# Altium project Arduino_Design_Project.PrjPcb
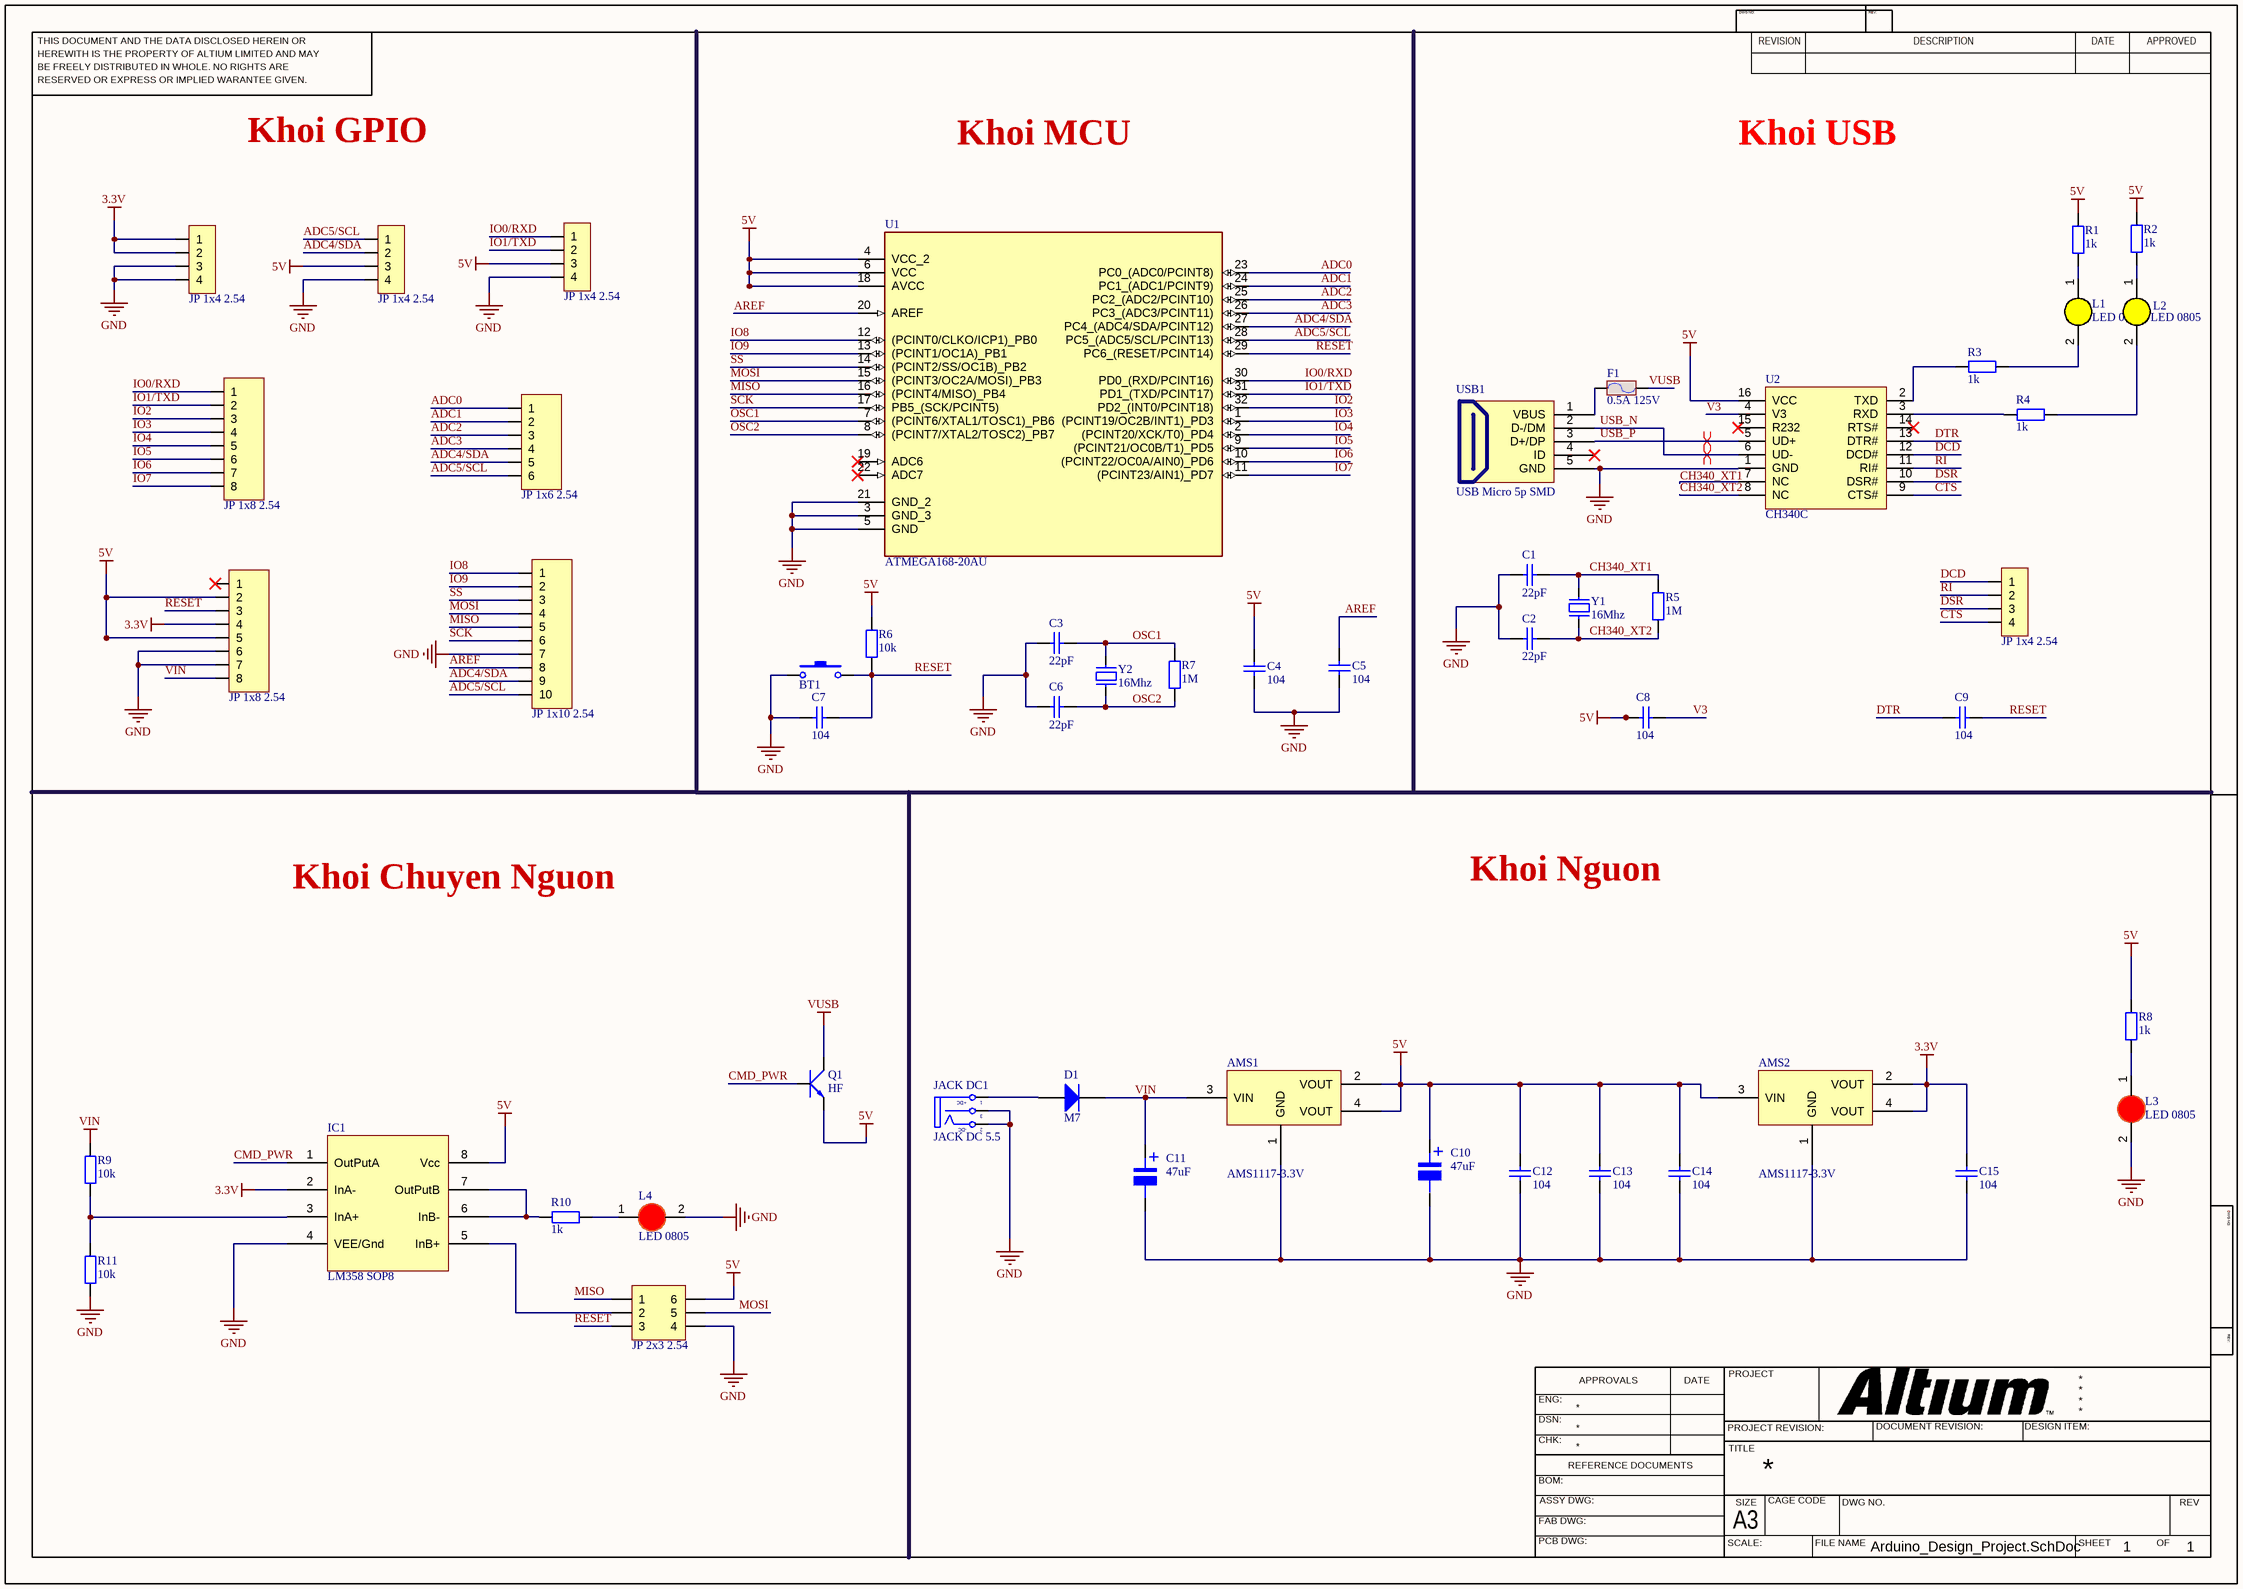
[diagram p0: Arduino_Design_Project.SchDoc]
1 sheet, 52 parts. Net scope: global (net labels, ports and power ports of the same name join across sheets).
Board file: Arduino_Design_Project.PcbDoc

## Sheet Arduino_Design_Project.SchDoc
size 420 x 297 mm; SheetNumber: 1; SheetTotal: 1

### Parts
AMS1  AMS1117-3.3V  [SOT223]
AMS2  AMS1117-3.3V  [SOT223]
BT1  Nut Nhan 2 Chan SMD 3x6x2.5  [Nut Nhan 2 Chan SMD 3x6x2.5]  (value not drawn)
C1  22pF  [tu 0805]
C2  22pF  [tu 0805]
C3  22pF  [tu 0805]
C4  104  [tu 0805]
C5  104  [tu 0805]
C6  22pF  [tu 0805]
C7  104  [tu 0805]
C8  104  [tu 0805]
C9  104  [tu 0805]
C10  47uF  [tu nhom 6.3 (d)]
C11  47uF  [tu nhom 6.3 (d)]
C12  104  [tu 0805]
C13  104  [tu 0805]
C14  104  [tu 0805]
C15  104  [tu 0805]
D1  M7  [DIODE SMA]
F1  0.5A 125V  [Cau Chi SMD1808]
IC1  LM358 SOP8  [SOP 8]
JACK_DC1  JACK DC 5.5  [JACK DC 5.5]
JP1  JP 1x4 2.54  [JP 1x4 CT]
JP2  JP 1x4 2.54  [JP 1x4 CT]
JP3  JP 1x4 2.54  [JP 1x4 CT]
JP4  JP 1x8 2.54  [JP 1x8 CT]
JP5  JP 1x6 2.54  [JP 1x6 CT]
JP6  JP 1x10 2.54  [JP 1x10 CT]
JP7  JP 1x4 2.54  [JP 1x4 CT]
JP8  JP 1x8 2.54  [JP 1x8 CT]
JP9  JP 2x3 2.54  [JP 2x3 DT]
L1  LED 0805  [LED-0805-Yellow]
L2  LED 0805  [LED-0805-Yellow]
L3  LED 0805  [LED-0805-Red]
L4  LED 0805  [LED-0805-Red]
Q1  HF  [SOT-23]
R1  1k  [tro smd 0805]
R2  1k  [tro smd 0805]
R3  1k  [tro smd 0805]
R4  1k  [tro smd 0805]
R5  1M  [tro smd 0805]
R6  10k  [tro smd 0805]
R7  1M  [tro smd 0805]
R8  1k  [tro smd 0805]
R9  10k  [tro smd 0805]
R10  1k  [tro smd 0805]
R11  10k  [tro smd 0805]
U1  ATMEGA168-20AU  [ATMEGA168]
U2  CH340C  [SOIC16_50_284_25X90_SMT]
USB1  USB Micro 5p SMD  [USB Micro 5p SMD]
Y1  16Mhz  [Thach Anh 2 chan SMD]
Y2  16Mhz  [Thach Anh 2 chan SMD]

### Nets
3.3V: AMS2.2(VOUT) AMS2.4(VOUT) C15.1 IC1.2(InA-) JP2.1 JP2.2 JP8.4
5V: AMS1.2(VOUT) AMS1.4(VOUT) AMS2.3(VIN) C4.1 C8.2 C10.1 C12.1 C13.1 C14.1 IC1.8(Vcc) JP1.3 JP3.3 JP8.2 JP8.5 JP9.6 Q1.2(E) R1.1 R2.2 R6.1 R8.2 U1.4(VCC_2) U1.6(VCC) U1.18(AVCC) U2.16(VCC)
GND: AMS1.1(GND) AMS2.1(GND) BT1.1 C1.2 C2.2 C3.2 C4.2 C5.1 C6.2 C7.2 C10.2 C11.2 C12.2 C13.2 C14.2 C15.2 IC1.4(VEE/Gnd) JACK_DC1.2(TN) JACK_DC1.3(S) JP1.4 JP2.3 JP2.4 JP3.4 JP6.7 JP8.6 JP8.7 JP9.4 L3.2(K) L4.2(K) R11.1 U1.3(GND_3) U1.5(GND) U1.21(GND_2) U2.1(GND) USB1.5(GND)
VIN: AMS1.3(VIN) C11.1 D1.2(K) JP8.8 R9.2
VUSB: F1.2 Q1.3(C)
ADC0: JP5.1 U1.23(PC0_(ADC0/PCINT8))
ADC1: JP5.2 U1.24(PC1_(ADC1/PCINT9))
ADC2: JP5.3 U1.25(PC2_(ADC2/PCINT10))
ADC3: JP5.4 U1.26(PC3_(ADC3/PCINT11))
ADC4/SDA: JP3.2 JP5.5 JP6.9 U1.27(PC4_(ADC4/SDA/PCINT12))
ADC5/SCL: JP3.1 JP5.6 JP6.10 U1.28(PC5_(ADC5/SCL/PCINT13))
AREF: C5.2 JP6.8 U1.20(AREF)
CH340_XT1: C1.1 R5.2 U2.7(NC) Y1.2
CH340_XT2: C2.1 R5.1 U2.8(NC) Y1.1
CMD_PWR: IC1.1(OutPutA) Q1.1(B)
CTS: JP7.4 U2.9(CTS#)
DCD: JP7.1 U2.12(DCD#)
DSR: JP7.3 U2.10(DSR#)
DTR: C9.1 U2.13(DTR#)
IO0/RXD: JP1.1 JP4.1 U1.30(PD0_(RXD/PCINT16))
IO1/TXD: JP1.2 JP4.2 U1.31(PD1_(TXD/PCINT17))
IO2: JP4.3 U1.32(PD2_(INT0/PCINT18))
IO3: JP4.4 U1.1((PCINT19/OC2B/INT1)_PD3)
IO4: JP4.5 U1.2((PCINT20/XCK/T0)_PD4)
IO5: JP4.6 U1.9((PCINT21/OC0B/T1)_PD5)
IO6: JP4.7 U1.10((PCINT22/OC0A/AIN0)_PD6)
IO7: JP4.8 U1.11((PCINT23/AIN1)_PD7)
IO8: JP6.1 U1.12((PCINT0/CLKO/ICP1)_PB0)
IO9: JP6.2 U1.13((PCINT1/OC1A)_PB1)
MISO: JP6.5 JP9.1 U1.16((PCINT4/MISO)_PB4)
MOSI: JP6.4 JP9.5 U1.15((PCINT3/OC2A/MOSI)_PB3)
OSC1: C3.1 R7.2 U1.7((PCINT6/XTAL1/TOSC1)_PB6) Y2.2
OSC2: C6.1 R7.1 U1.8((PCINT7/XTAL2/TOSC2)_PB7) Y2.1
RESET: BT1.2 C7.1 C9.2 JP8.3 JP9.3 R6.2 U1.29(PC6_(RESET/PCINT14))
RI: JP7.2 U2.11(RI#)
SCK: JP6.6 U1.17(PB5_(SCK/PCINT5))
SS: JP6.3 U1.14((PCINT2/SS/OC1B)_PB2)
USB_N: U2.6(UD-) USB1.2(D-/DM)
USB_P: U2.5(UD+) USB1.3(D+/DP)
V3: C8.1 U2.4(V3)
NetD1_1: D1.1(A) JACK_DC1.1(T)
NetF1_1: F1.1 USB1.1(VBUS)
NetIC1_3: IC1.3(InA+) R9.1 R11.2
NetIC1_5: IC1.5(InB+) JP9.2
NetIC1_6: IC1.6(InB-) IC1.7(OutPutB) R10.2
NetL1_1: L1.1(A) R1.2
NetL1_2: L1.2(K) R3.1
NetL2_1: L2.1(A) R2.1
NetL2_2: L2.2(K) R4.2
NetL3_1: L3.1(A) R8.1
NetL4_1: L4.1(A) R10.1
NetR3_2: R3.2 U2.2(TXD)
NetR4_1: R4.1 U2.3(RXD)

Not connected (* = marked no-connect by the designer): JP8 1*; U1 19(ADC6)* 22(ADC7)*; U2 14(RTS#)* 15(R232)*; USB1 4(ID)*

### Layout directives
differential pair: USB_N, USB_P

### Notes on the sheet
- Khoi GPIO
- Khoi MCU
- Khoi USB
- Khoi Chuyen Nguon
- Khoi Nguon
- THIS DOCUMENT AND THE DATA DISCLOSED HEREIN OR
- HEREWITH IS THE PROPERTY OF ALTIUM LIMITED AND MAY
- DWG NO:
- REVISION
- REV:
- DESCRIPTION
- DATE
- APPROVED
- BE FREELY DISTRIBUTED IN WHOLE. NO RIGHTS ARE
- RESERVED OR EXPRESS OR IMPLIED WARANTEE GIVEN.
- ENG:
- APPROVALS
- PROJECT
- DSN:
- CHK:
- REFERENCE DOCUMENTS
- PROJECT REVISION:
- TITLE
- DOCUMENT REVISION:
- DESIGN ITEM:
- BOM:
- FAB DWG:
- PCB DWG:
- ASSY DWG:
- SCALE:
- A3
- SIZE
- CAGE CODE
- FILE NAME
- DWG NO.
- SHEET
- OF
- REV
- (in symbol JACK DC 5.5) +DC; -DC
- (in symbol Tu Nhom 47uF 25V) +

### Library data of the parts
AMS1 AMS2 = AMS1117 SMD: Dán; Value: AMS1117-3.3V SOT223; Don_Vi: Con; Ma_Hang: MH000596; Ghi_Chu: *; Kieu_Chan: *; Chung_Loai: Dán
BT1 = Nut Nhan 2 Chan SMD 3x6x2.5: Ma_Hang: MH001036; Ten: Nút Nhấn 2 Chân 3x6x2.5MM SMD
C1-C3 C6 = Tu 0805 22pF 50V 10%: Dán; Don_Vi: Con; So_Chan: 2; Ten_Linh_Kien: Tụ 0805 22P 10% 50V; Ma_Hang: MH004560; Chung_Loai: Dán; Kieu_Chan: *
C4 C5 C7-C9 C12-C15 = Tu 0805 104 50V 10%: Dán; Don_Vi: Con; So_Chan: 2; Ten_Linh_Kien: Tụ 0805 104-100nF 10% 50V; Ma_Hang: MH004551; Chung_Loai: Dán; Kieu_Chan: *
C10 C11 = Tu Nhom 47uF 25V: Dán; Don_Vi: Con; So_Chan: 2; Ten_Linh_Kien: Tụ Nhôm 47uF 25V 6.3x5.5MM; Ma_Hang: MH002216; Chung_Loai: Dán; Kieu_Chan: *
D1 = Diode M7 ( 4007 ): Dán; Don_Vi: Con; Ten_Linh_Kien: Diode M7 1N4007 SMD 1A 1000V; Ma_Hang: MH000944; Chung_Loai: Dán; Ghi_Chu: *
F1 = Cau chi 0.5A 125V SMD1808: Ma_Hang: MH009241; Ten: Cầu Chì 0.5A 125V SMD1808 0451.500MRL
IC1 = LM358 SOP8: Dán; Ma_Hang: MH000609; Don_Vi: Con; Ten_Linh_Kien: LM358 SOP8; Kieu_Chan: *; Ghi_Chu: *; Chung_Loai: Dán
JACK_DC1 = JACK DC 5.5: Value: Jac DC
JP1-JP3 JP7 = JP 1x4 2.54 Cai Thang: Cắm; Ten_Linh_Kien: Jump Đơn Cái 2.54MM 1x20P Thẳng; Don_Vi: Con; Ma_Hang: MH004006; Ghi_Chu: *; Kieu_Chan: *; Chung_Loai: Cắm
JP4 JP8 = JP 1x8 2.54 Cai Thang: Cắm; Ten_Linh_Kien: Jump Đơn Cái 2.54MM 1x20P Thẳng; Don_Vi: Con; Ma_Hang: MH004006; Ghi_Chu: *; Kieu_Chan: *; Chung_Loai: Cắm
JP5 = JP 1x6 2.54 Cai Thang: Cắm; Ten_Linh_Kien: Jump Đơn Cái 2.54MM 1x20P Thẳng; Don_Vi: Con; Ma_Hang: MH004006; Ghi_Chu: *; Kieu_Chan: *; Chung_Loai: Cắm
JP6 = JP 1x10 2.54 Cai Thang: Cắm; Ten_Linh_Kien: Jump Đơn Cái 2.54MM 1x20P Thẳng; Don_Vi: Con; Ma_Hang: MH004006; Ghi_Chu: *; Kieu_Chan: *; Chung_Loai: Cắm
JP9 = JP 2x3 2.54 Duc Thang: Cắm; Ten_Linh_Kien: Jump Đôi Đực 2.54MM 2x40P Thẳng 11MM; Don_Vi: Con; Ma_Hang: MH002686; Ghi_Chu: *; Kieu_Chan: *; Chung_Loai: Cắm
L1 L2 = LED 0805 Vang: Dán; Don_Vi: Con; Ma_Hang: MH002329; Ten_Linh_Kien: LED 0805 Màu Vàng ( Yellow); Ghi_Chu: *; Kieu_Chan: *; Chung_Loai: Dán
L3 L4 = LED 0805 Do: Dán; Don_Vi: Con; Ma_Hang: MH000897; Ten_Linh_Kien: LED 0805 Màu Đỏ (Red); Ghi_Chu: *; Kieu_Chan: *; Chung_Loai: Dán
Q1 = Trans C1815 HF SMD: SOT-23; Value: C9014
R1-R4 R8 R10 = Tro 0805 1% 1k: Dán; Don_Vi: Con; So_Chan: 2; Ten_Linh_Kien: Trở 0805 1% 1k; Ma_Hang: MH005468; Chung_Loai: Dán; Kieu_Chan: *
R5 R7 = Tro 0805 5% 1M: Dán; Don_Vi: Con; So_Chan: 2; Ten_Linh_Kien: Trở 0805 5% 1M; Ma_Hang: MH005235; Chung_Loai: Dán; Kieu_Chan: *
R6 = Tro 0805 5% 10k: Dán; Don_Vi: Con; So_Chan: 2; Ten_Linh_Kien: Trở 0805 5% 10k; Ma_Hang: MH005239; Chung_Loai: Dán; Kieu_Chan: *
R9 R11 = Tro 0805 1% 10k: Dán; Don_Vi: Con; So_Chan: 2; Ten_Linh_Kien: Trở 0805 1% 10k; Ma_Hang: MH005473; Chung_Loai: Dán; Kieu_Chan: *
U1 = ATMEGA168-20AU: AVR AVRÂ® ATmega Microcontroller IC 8-Bit 20MHz 16KB _8K x 16_ FLASH 32-TQFP _7x7_; MF: Microchip; MP: ATMEGA168-20AU; Availability: Unavailable; Package: TQFP-32 Microchip; Price: None; SnapEDA_Link: https://www.snapeda.com/parts/ATMEGA168-20AU/Microchip/view-part/776709/?ref=snap; Value: *
U2 = CH340C: USB Bridge, USB to UART USB 2.0 UART Interface; Manufacturer: Olimex; Alternate Part Number-1: NA; Manufacturer Part Number: CH340C; Case/Package: SOIC16; Supplier-1: LCSC; Supplier Part Number-1: C84681
USB1 = USB Micro 5p SMD: USB Type B; Ten: MicroUSB MK5P SMD; Ma_Hang: MH001020
Y1 Y2 = Thach Anh 2 chan SMD: Crystal For all Crystal 2pin.; Value: 4Mhz